# EAGLE schematic pressure_mat_try1 (EAGLE 9.3.1)

## Sheet 1 of 2
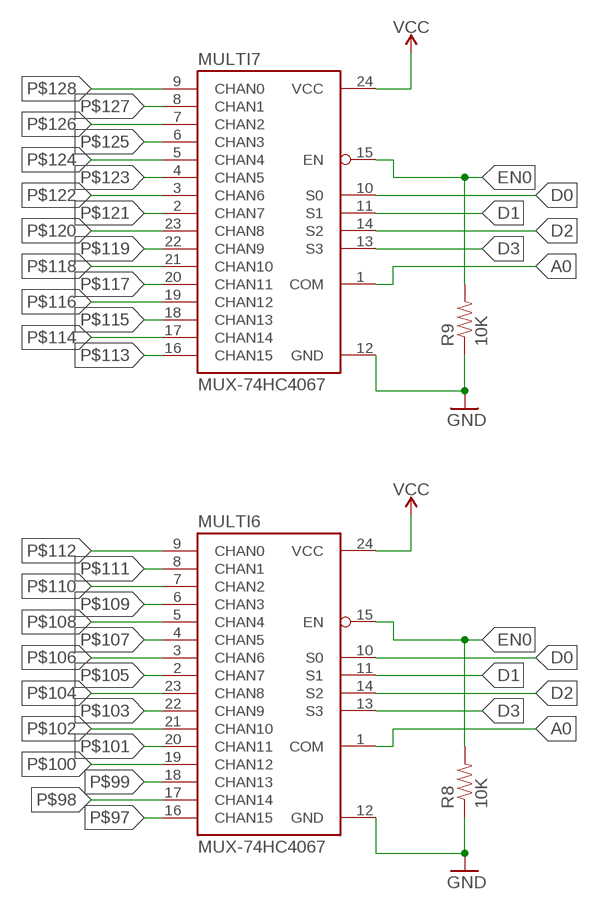
[diagram p0: schematic, sheet 1, part 1 of 3]
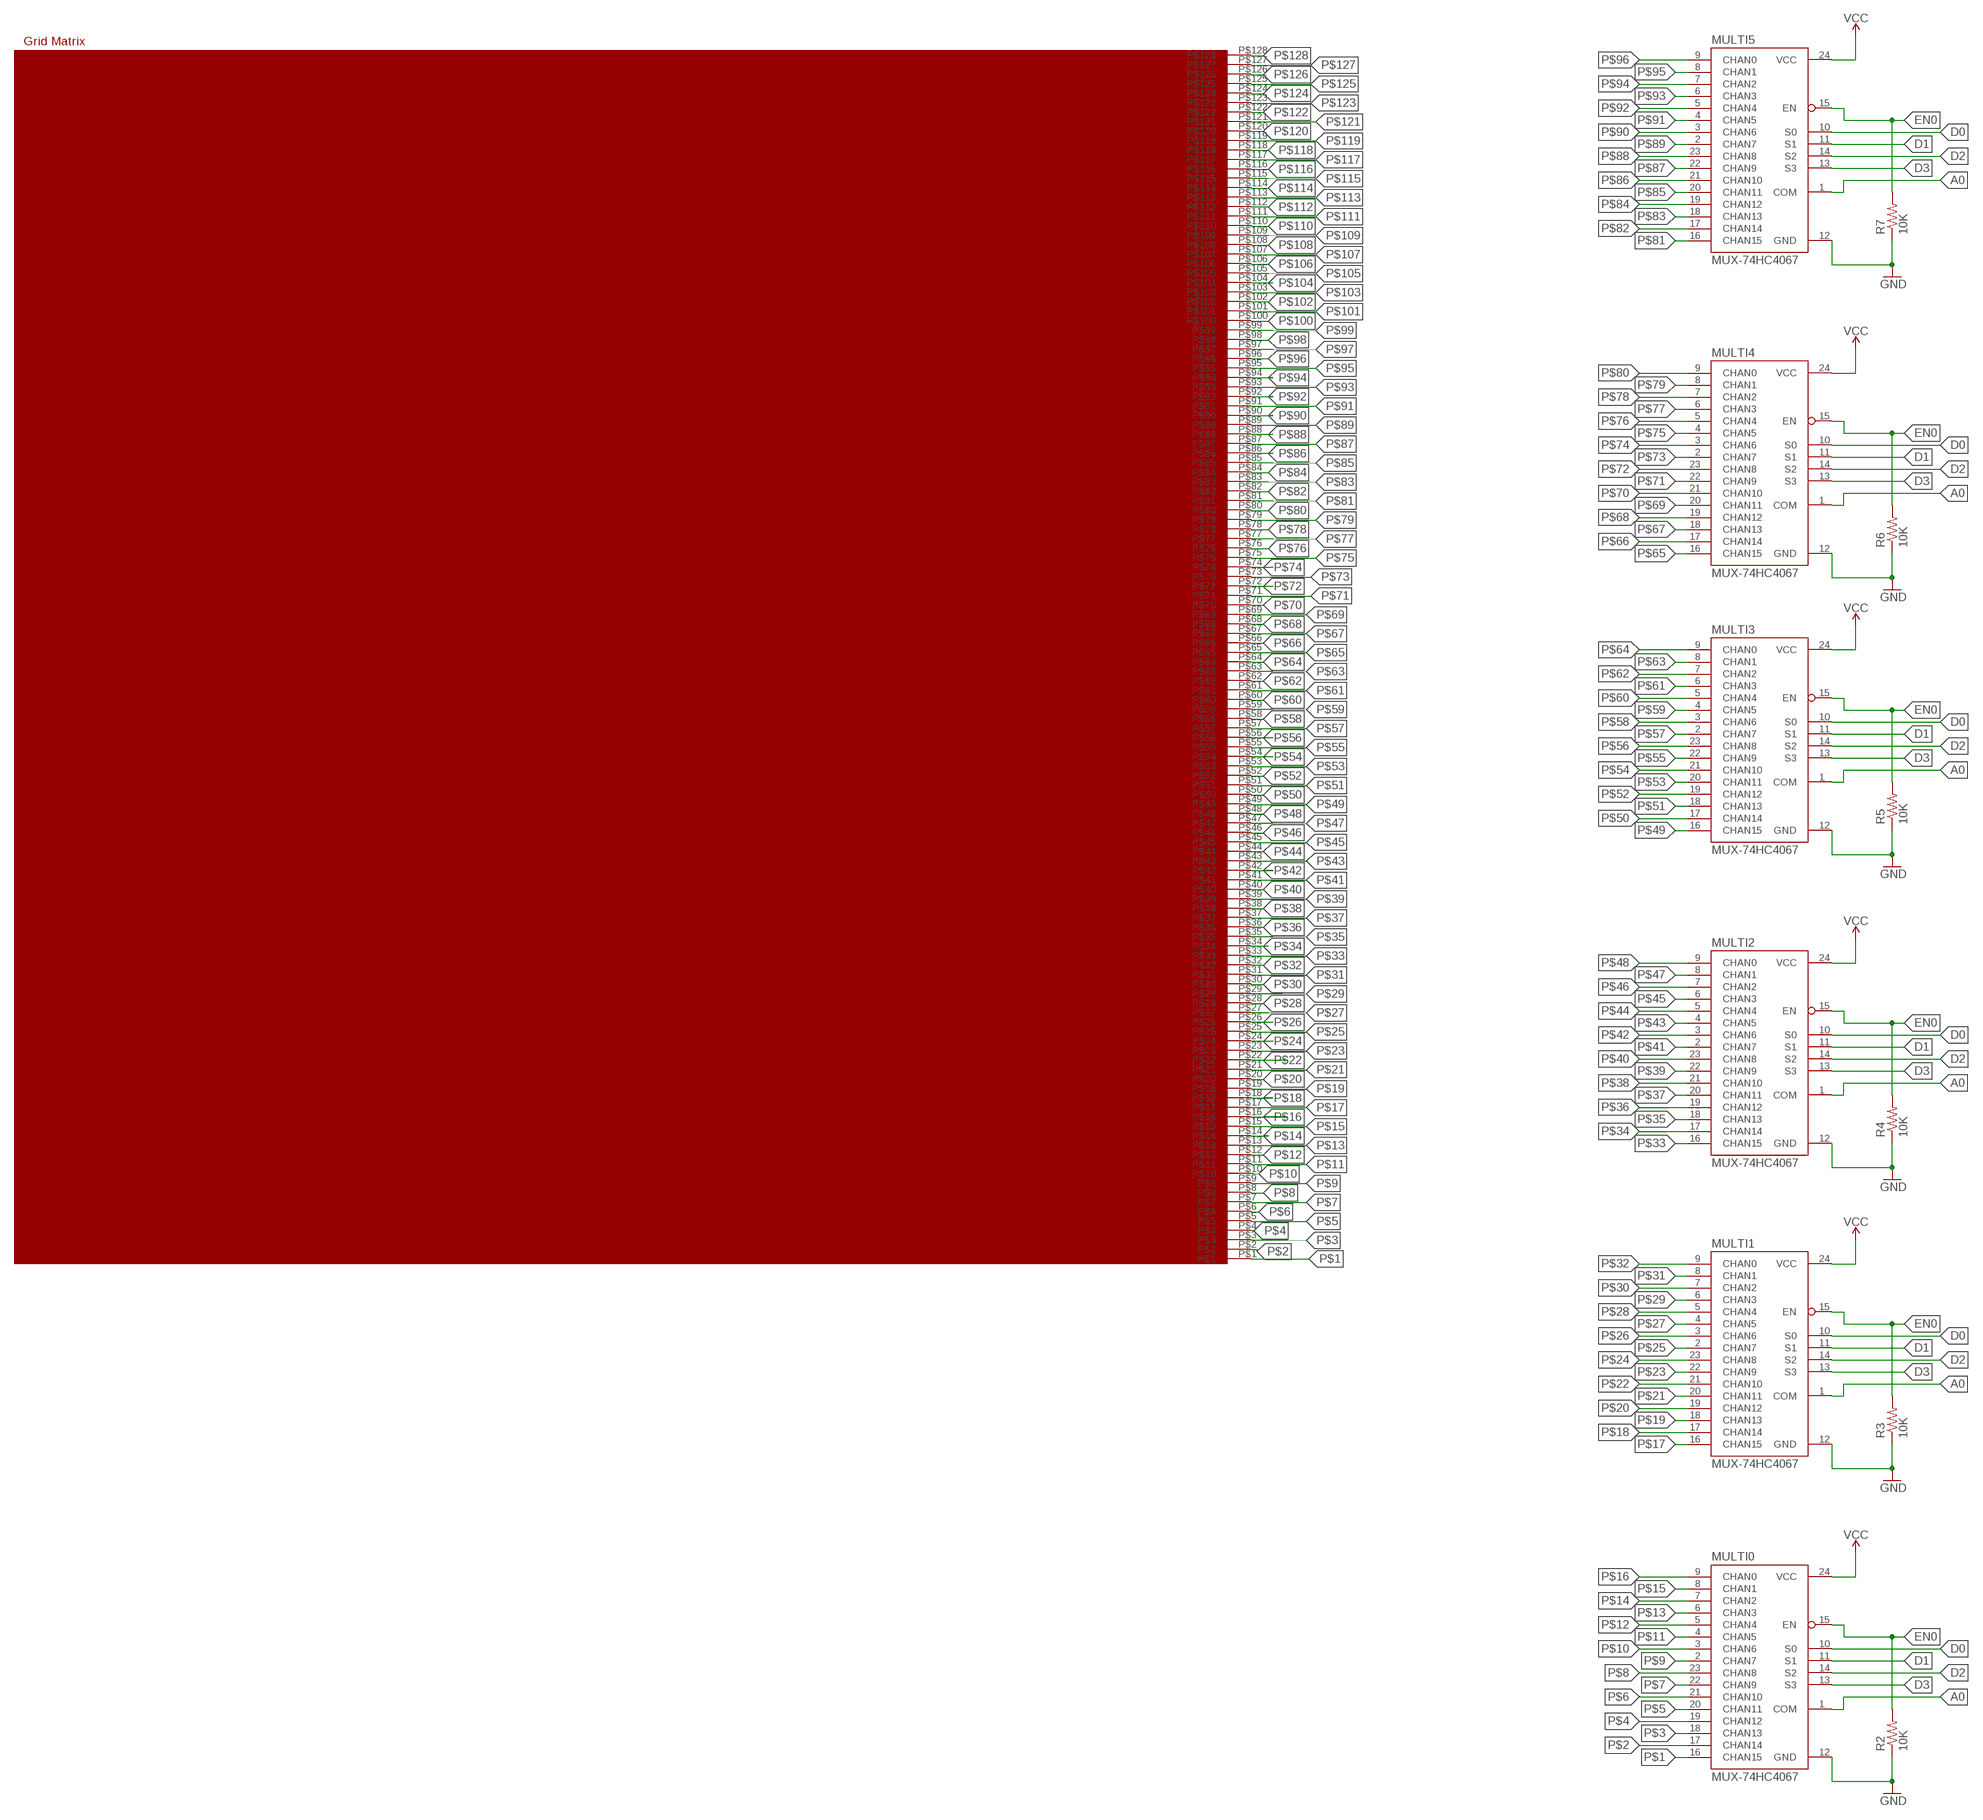
[diagram p1: schematic, sheet 1, part 2 of 3]
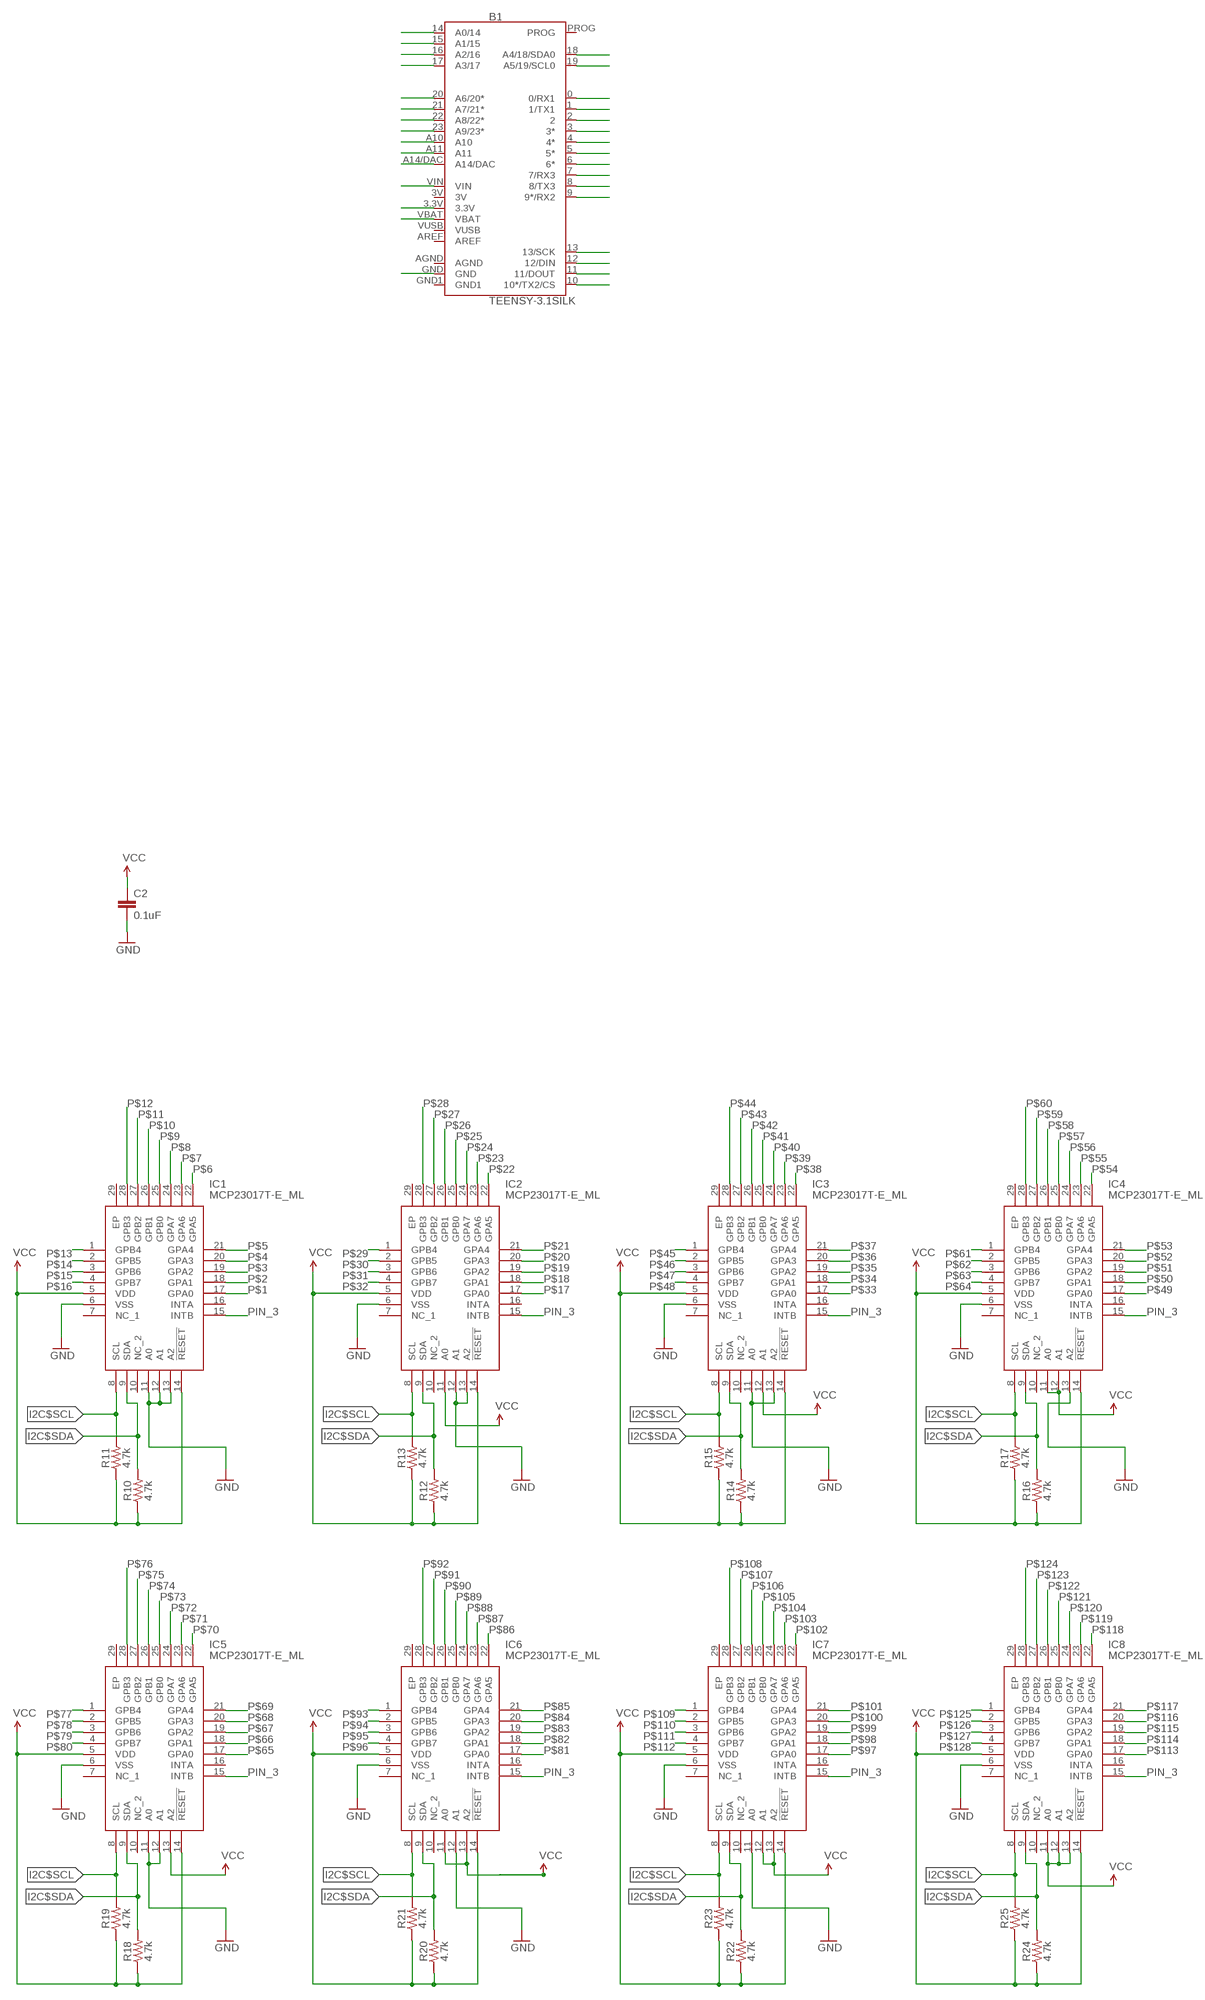
[diagram p2: schematic, sheet 1, part 3 of 3]

### Parts
B1  TEENSY-3.1SILK  [TEENSY-3.1]
C2  0.1uF  CAP0603  [0603]
IC1  MCP23017T-E_ML  [QFN65P600X600X100-29N]
IC2  MCP23017T-E_ML  [QFN65P600X600X100-29N]
IC3  MCP23017T-E_ML  [QFN65P600X600X100-29N]
IC4  MCP23017T-E_ML  [QFN65P600X600X100-29N]
IC5  MCP23017T-E_ML  [QFN65P600X600X100-29N]
IC6  MCP23017T-E_ML  [QFN65P600X600X100-29N]
IC7  MCP23017T-E_ML  [QFN65P600X600X100-29N]
IC8  MCP23017T-E_ML  [QFN65P600X600X100-29N]
MULTI0  MUX-74HC4067  MUX-74HC4067SMD  [SSOP24]
MULTI1  MUX-74HC4067  MUX-74HC4067SMD  [SSOP24]
MULTI2  MUX-74HC4067  MUX-74HC4067SMD  [SSOP24]
MULTI3  MUX-74HC4067  MUX-74HC4067SMD  [SSOP24]
MULTI4  MUX-74HC4067  MUX-74HC4067SMD  [SSOP24]
MULTI5  MUX-74HC4067  MUX-74HC4067SMD  [SSOP24]
MULTI6  MUX-74HC4067  MUX-74HC4067SMD  [SSOP24]
MULTI7  MUX-74HC4067  MUX-74HC4067SMD  [SSOP24]
R2  10K  RESISTOR0603  [0603]
R3  10K  RESISTOR0603  [0603]
R4  10K  RESISTOR0603  [0603]
R5  10K  RESISTOR0603  [0603]
R6  10K  RESISTOR0603  [0603]
R7  10K  RESISTOR0603  [0603]
R8  10K  RESISTOR0603  [0603]
R9  10K  RESISTOR0603  [0603]
R10  4.7k  4.7KOHM-0603-1/10W-1%  [0603]
R11  4.7k  4.7KOHM-0603-1/10W-1%  [0603]
R12  4.7k  4.7KOHM-0603-1/10W-1%  [0603]
R13  4.7k  4.7KOHM-0603-1/10W-1%  [0603]
R14  4.7k  4.7KOHM-0603-1/10W-1%  [0603]
R15  4.7k  4.7KOHM-0603-1/10W-1%  [0603]
R16  4.7k  4.7KOHM-0603-1/10W-1%  [0603]
R17  4.7k  4.7KOHM-0603-1/10W-1%  [0603]
R18  4.7k  4.7KOHM-0603-1/10W-1%  [0603]
R19  4.7k  4.7KOHM-0603-1/10W-1%  [0603]
R20  4.7k  4.7KOHM-0603-1/10W-1%  [0603]
R21  4.7k  4.7KOHM-0603-1/10W-1%  [0603]
R22  4.7k  4.7KOHM-0603-1/10W-1%  [0603]
R23  4.7k  4.7KOHM-0603-1/10W-1%  [0603]
R24  4.7k  4.7KOHM-0603-1/10W-1%  [0603]
R25  4.7k  4.7KOHM-0603-1/10W-1%  [0603]
U$3  SENSOR_GRID_V1.0  [SENSOR_GRID_V1.0]

### Nets
A0: MULTI0.1(COM) MULTI1.1(COM) MULTI2.1(COM) MULTI3.1(COM) MULTI4.1(COM) MULTI5.1(COM) MULTI6.1(COM) MULTI7.1(COM)
D0: MULTI0.10(S0) MULTI1.10(S0) MULTI2.10(S0) MULTI3.10(S0) MULTI4.10(S0) MULTI5.10(S0) MULTI6.10(S0) MULTI7.10(S0)
D1: MULTI0.11(S1) MULTI1.11(S1) MULTI2.11(S1) MULTI3.11(S1) MULTI4.11(S1) MULTI5.11(S1) MULTI6.11(S1) MULTI7.11(S1)
D2: MULTI0.14(S2) MULTI1.14(S2) MULTI2.14(S2) MULTI3.14(S2) MULTI4.14(S2) MULTI5.14(S2) MULTI6.14(S2) MULTI7.14(S2)
D3: MULTI0.13(S3) MULTI1.13(S3) MULTI2.13(S3) MULTI3.13(S3) MULTI4.13(S3) MULTI5.13(S3) MULTI6.13(S3) MULTI7.13(S3)
EN0: MULTI0.15(EN) MULTI1.15(EN) MULTI2.15(EN) MULTI3.15(EN) MULTI4.15(EN) MULTI5.15(EN) MULTI6.15(EN) MULTI7.15(EN) R2.2 R3.2 R4.2 R5.2 R6.2 R7.2 R8.2 R9.2
GND: C2.2 IC1.6(VSS) IC1.11(A0) IC1.12(A1) IC1.13(A2) IC2.6(VSS) IC2.12(A1) IC2.13(A2) IC3.6(VSS) IC3.11(A0) IC3.13(A2) IC4.6(VSS) IC4.13(A2) IC5.6(VSS) IC5.11(A0) IC5.12(A1) IC6.6(VSS) IC6.12(A1) IC7.6(VSS) IC7.11(A0) IC8.6(VSS) MULTI0.12(GND) MULTI1.12(GND) MULTI2.12(GND) MULTI3.12(GND) MULTI4.12(GND) MULTI5.12(GND) MULTI6.12(GND) MULTI7.12(GND) R2.1 R3.1 R4.1 R5.1 R6.1 R7.1 R8.1 R9.1 ; also sheet 2
I2C$SCL: IC1.8(SCL) IC2.8(SCL) IC3.8(SCL) IC4.8(SCL) IC5.8(SCL) IC6.8(SCL) IC7.8(SCL) IC8.8(SCL) R11.2 R13.2 R15.2 R17.2 R19.2 R21.2 R23.2 R25.2
I2C$SDA: IC1.9(SDA) IC2.9(SDA) IC3.9(SDA) IC4.9(SDA) IC5.9(SDA) IC6.9(SDA) IC7.9(SDA) IC8.9(SDA) R10.2 R12.2 R14.2 R16.2 R18.2 R20.2 R22.2 R24.2
N$1: B1.14(A0/14)
N$2: B1.15(A1/15)
N$3: B1.16(A2/16)
N$4: B1.17(A3/17)
N$5: B1.20(A6/20*)
N$6: B1.21(A7/21*)
N$7: B1.22(A8/22*)
N$8: B1.23(A9/23*)
N$9: B1.A10
N$10: B1.A11
N$11: B1.A14/DAC
N$12: B1.VIN
N$13: B1.3.3V
N$14: B1.GND
N$15: B1.18(A4/18/SDA0)
N$16: B1.VBAT
N$17: B1.19(A5/19/SCL0)
N$18: B1.0(0/RX1)
N$19: B1.1(1/TX1)
N$20: B1.2
N$21: B1.3(3*)
N$22: B1.4(4*)
N$23: B1.5(5*)
N$24: B1.6(6*)
N$25: B1.7(7/RX3)
N$26: B1.8(8/TX3)
N$27: B1.9(9*/RX2)
N$28: B1.13(13/SCK)
N$29: B1.12(12/DIN)
N$30: B1.11(11/DOUT)
N$31: B1.10(10*/TX2/CS)
P$1: IC1.17(GPA0) MULTI0.16(CHAN15) U$3.P$1
P$2: IC1.18(GPA1) MULTI0.17(CHAN14) U$3.P$2
P$3: IC1.19(GPA2) MULTI0.18(CHAN13) U$3.P$3
P$4: IC1.20(GPA3) MULTI0.19(CHAN12) U$3.P$4
P$5: IC1.21(GPA4) MULTI0.20(CHAN11) U$3.P$5
P$6: IC1.22(GPA5) MULTI0.21(CHAN10) U$3.P$6
P$7: IC1.23(GPA6) MULTI0.22(CHAN9) U$3.P$7
P$8: IC1.24(GPA7) MULTI0.23(CHAN8) U$3.P$8
P$9: IC1.25(GPB0) MULTI0.2(CHAN7) U$3.P$9
P$10: IC1.26(GPB1) MULTI0.3(CHAN6) U$3.P$10
P$11: IC1.27(GPB2) MULTI0.4(CHAN5) U$3.P$11
P$12: IC1.28(GPB3) MULTI0.5(CHAN4) U$3.P$12
P$13: IC1.1(GPB4) MULTI0.6(CHAN3) U$3.P$13
P$14: IC1.2(GPB5) MULTI0.7(CHAN2) U$3.P$14
P$15: IC1.3(GPB6) MULTI0.8(CHAN1) U$3.P$15
P$16: IC1.4(GPB7) MULTI0.9(CHAN0) U$3.P$16
P$17: IC2.17(GPA0) MULTI1.16(CHAN15) U$3.P$17
P$18: IC2.18(GPA1) MULTI1.17(CHAN14) U$3.P$18
P$19: IC2.19(GPA2) MULTI1.18(CHAN13) U$3.P$19
P$20: IC2.20(GPA3) MULTI1.19(CHAN12) U$3.P$20
P$21: IC2.21(GPA4) MULTI1.20(CHAN11) U$3.P$21
P$22: IC2.22(GPA5) MULTI1.21(CHAN10) U$3.P$22
P$23: IC2.23(GPA6) MULTI1.22(CHAN9) U$3.P$23
P$24: IC2.24(GPA7) MULTI1.23(CHAN8) U$3.P$24
P$25: IC2.25(GPB0) MULTI1.2(CHAN7) U$3.P$25
P$26: IC2.26(GPB1) MULTI1.3(CHAN6) U$3.P$26
P$27: IC2.27(GPB2) MULTI1.4(CHAN5) U$3.P$27
P$28: IC2.28(GPB3) MULTI1.5(CHAN4) U$3.P$28
P$29: IC2.1(GPB4) MULTI1.6(CHAN3) U$3.P$29
P$30: IC2.2(GPB5) MULTI1.7(CHAN2) U$3.P$30
P$31: IC2.3(GPB6) MULTI1.8(CHAN1) U$3.P$31
P$32: IC2.4(GPB7) MULTI1.9(CHAN0) U$3.P$32
P$33: IC3.17(GPA0) MULTI2.16(CHAN15) U$3.P$33
P$34: IC3.18(GPA1) MULTI2.17(CHAN14) U$3.P$34
P$35: IC3.19(GPA2) MULTI2.18(CHAN13) U$3.P$35
P$36: IC3.20(GPA3) MULTI2.19(CHAN12) U$3.P$36
P$37: IC3.21(GPA4) MULTI2.20(CHAN11) U$3.P$37
P$38: IC3.22(GPA5) MULTI2.21(CHAN10) U$3.P$38
P$39: IC3.23(GPA6) MULTI2.22(CHAN9) U$3.P$39
P$40: IC3.24(GPA7) MULTI2.23(CHAN8) U$3.P$40
P$41: IC3.25(GPB0) MULTI2.2(CHAN7) U$3.P$41
P$42: IC3.26(GPB1) MULTI2.3(CHAN6) U$3.P$42
P$43: IC3.27(GPB2) MULTI2.4(CHAN5) U$3.P$43
P$44: IC3.28(GPB3) MULTI2.5(CHAN4) U$3.P$44
P$45: IC3.1(GPB4) MULTI2.6(CHAN3) U$3.P$45
P$46: IC3.2(GPB5) MULTI2.7(CHAN2) U$3.P$46
P$47: IC3.3(GPB6) MULTI2.8(CHAN1) U$3.P$47
P$48: IC3.4(GPB7) MULTI2.9(CHAN0) U$3.P$48
P$49: IC4.17(GPA0) MULTI3.16(CHAN15) U$3.P$49
P$50: IC4.18(GPA1) MULTI3.17(CHAN14) U$3.P$50
P$51: IC4.19(GPA2) MULTI3.18(CHAN13) U$3.P$51
P$52: IC4.20(GPA3) MULTI3.19(CHAN12) U$3.P$52
P$53: IC4.21(GPA4) MULTI3.20(CHAN11) U$3.P$53
P$54: IC4.22(GPA5) MULTI3.21(CHAN10) U$3.P$54
P$55: IC4.23(GPA6) MULTI3.22(CHAN9) U$3.P$55
P$56: IC4.24(GPA7) MULTI3.23(CHAN8) U$3.P$56
P$57: IC4.25(GPB0) MULTI3.2(CHAN7) U$3.P$57
P$58: IC4.26(GPB1) MULTI3.3(CHAN6) U$3.P$58
P$59: IC4.27(GPB2) MULTI3.4(CHAN5) U$3.P$59
P$60: IC4.28(GPB3) MULTI3.5(CHAN4) U$3.P$60
P$61: IC4.1(GPB4) MULTI3.6(CHAN3) U$3.P$61
P$62: IC4.2(GPB5) MULTI3.7(CHAN2) U$3.P$62
P$63: IC4.3(GPB6) MULTI3.8(CHAN1) U$3.P$63
P$64: IC4.4(GPB7) MULTI3.9(CHAN0) U$3.P$64
P$65: IC5.17(GPA0) MULTI4.16(CHAN15) U$3.P$65
P$66: IC5.18(GPA1) MULTI4.17(CHAN14) U$3.P$66
P$67: IC5.19(GPA2) MULTI4.18(CHAN13) U$3.P$67
P$68: IC5.20(GPA3) MULTI4.19(CHAN12) U$3.P$68
P$69: IC5.21(GPA4) MULTI4.20(CHAN11) U$3.P$69
P$70: IC5.22(GPA5) MULTI4.21(CHAN10) U$3.P$70
P$71: IC5.23(GPA6) MULTI4.22(CHAN9) U$3.P$71
P$72: IC5.24(GPA7) MULTI4.23(CHAN8) U$3.P$72
P$73: IC5.25(GPB0) MULTI4.2(CHAN7) U$3.P$73
P$74: IC5.26(GPB1) MULTI4.3(CHAN6) U$3.P$74
P$75: IC5.27(GPB2) MULTI4.4(CHAN5) U$3.P$75
P$76: IC5.28(GPB3) MULTI4.5(CHAN4) U$3.P$76
P$77: IC5.1(GPB4) MULTI4.6(CHAN3) U$3.P$77
P$78: IC5.2(GPB5) MULTI4.7(CHAN2) U$3.P$78
P$79: IC5.3(GPB6) MULTI4.8(CHAN1) U$3.P$79
P$80: IC5.4(GPB7) MULTI4.9(CHAN0) U$3.P$80
P$81: IC6.17(GPA0) MULTI5.16(CHAN15) U$3.P$81
P$82: IC6.18(GPA1) MULTI5.17(CHAN14) U$3.P$82
P$83: IC6.19(GPA2) MULTI5.18(CHAN13) U$3.P$83
P$84: IC6.20(GPA3) MULTI5.19(CHAN12) U$3.P$84
P$85: IC6.21(GPA4) MULTI5.20(CHAN11) U$3.P$85
P$86: IC6.22(GPA5) MULTI5.21(CHAN10) U$3.P$86
P$87: IC6.23(GPA6) MULTI5.22(CHAN9) U$3.P$87
P$88: IC6.24(GPA7) MULTI5.23(CHAN8) U$3.P$88
P$89: IC6.25(GPB0) MULTI5.2(CHAN7) U$3.P$89
P$90: IC6.26(GPB1) MULTI5.3(CHAN6) U$3.P$90
P$91: IC6.27(GPB2) MULTI5.4(CHAN5) U$3.P$91
P$92: IC6.28(GPB3) MULTI5.5(CHAN4) U$3.P$92
P$93: IC6.1(GPB4) MULTI5.6(CHAN3) U$3.P$93
P$94: IC6.2(GPB5) MULTI5.7(CHAN2) U$3.P$94
P$95: IC6.3(GPB6) MULTI5.8(CHAN1) U$3.P$95
P$96: IC6.4(GPB7) MULTI5.9(CHAN0) U$3.P$96
P$97: IC7.17(GPA0) MULTI6.16(CHAN15) U$3.P$97
P$98: IC7.18(GPA1) MULTI6.17(CHAN14) U$3.P$98
P$99: IC7.19(GPA2) MULTI6.18(CHAN13) U$3.P$99
P$100: IC7.20(GPA3) MULTI6.19(CHAN12) U$3.P$100
P$101: IC7.21(GPA4) MULTI6.20(CHAN11) U$3.P$101
P$102: IC7.22(GPA5) MULTI6.21(CHAN10) U$3.P$102
P$103: IC7.23(GPA6) MULTI6.22(CHAN9) U$3.P$103
P$104: IC7.24(GPA7) MULTI6.23(CHAN8) U$3.P$104
P$105: IC7.25(GPB0) MULTI6.2(CHAN7) U$3.P$105
P$106: IC7.26(GPB1) MULTI6.3(CHAN6) U$3.P$106
P$107: IC7.27(GPB2) MULTI6.4(CHAN5) U$3.P$107
P$108: IC7.28(GPB3) MULTI6.5(CHAN4) U$3.P$108
P$109: IC7.1(GPB4) MULTI6.6(CHAN3) U$3.P$109
P$110: IC7.2(GPB5) MULTI6.7(CHAN2) U$3.P$110
P$111: IC7.3(GPB6) MULTI6.8(CHAN1) U$3.P$111
P$112: IC7.4(GPB7) MULTI6.9(CHAN0) U$3.P$112
P$113: IC8.17(GPA0) MULTI7.16(CHAN15) U$3.P$113
P$114: IC8.18(GPA1) MULTI7.17(CHAN14) U$3.P$114
P$115: IC8.19(GPA2) MULTI7.18(CHAN13) U$3.P$115
P$116: IC8.20(GPA3) MULTI7.19(CHAN12) U$3.P$116
P$117: IC8.21(GPA4) MULTI7.20(CHAN11) U$3.P$117
P$118: IC8.22(GPA5) MULTI7.21(CHAN10) U$3.P$118
P$119: IC8.23(GPA6) MULTI7.22(CHAN9) U$3.P$119
P$120: IC8.24(GPA7) MULTI7.23(CHAN8) U$3.P$120
P$121: IC8.25(GPB0) MULTI7.2(CHAN7) U$3.P$121
P$122: IC8.26(GPB1) MULTI7.3(CHAN6) U$3.P$122
P$123: IC8.27(GPB2) MULTI7.4(CHAN5) U$3.P$123
P$124: IC8.28(GPB3) MULTI7.5(CHAN4) U$3.P$124
P$125: IC8.1(GPB4) MULTI7.6(CHAN3) U$3.P$125
P$126: IC8.2(GPB5) MULTI7.7(CHAN2) U$3.P$126
P$127: IC8.3(GPB6) MULTI7.8(CHAN1) U$3.P$127
P$128: IC8.4(GPB7) MULTI7.9(CHAN0) U$3.P$128
PIN_3: IC1.15(INTB) IC2.15(INTB) IC3.15(INTB) IC4.15(INTB) IC5.15(INTB) IC6.15(INTB) IC7.15(INTB) IC8.15(INTB)
VCC: C2.1 IC1.5(VDD) IC1.14(!RESET) IC2.5(VDD) IC2.11(A0) IC2.14(!RESET) IC3.5(VDD) IC3.12(A1) IC3.14(!RESET) IC4.5(VDD) IC4.11(A0) IC4.12(A1) IC4.14(!RESET) IC5.5(VDD) IC5.13(A2) IC5.14(!RESET) IC6.5(VDD) IC6.11(A0) IC6.13(A2) IC6.14(!RESET) IC7.5(VDD) IC7.12(A1) IC7.13(A2) IC7.14(!RESET) IC8.5(VDD) IC8.11(A0) IC8.12(A1) IC8.13(A2) IC8.14(!RESET) MULTI0.24(VCC) MULTI1.24(VCC) MULTI2.24(VCC) MULTI3.24(VCC) MULTI4.24(VCC) MULTI5.24(VCC) MULTI6.24(VCC) MULTI7.24(VCC) R10.1 R11.1 R12.1 R13.1 R14.1 R15.1 R16.1 R17.1 R18.1 R19.1 R20.1 R21.1 R22.1 R23.1 R24.1 R25.1 ; also sheet 2
Unconnected: B1.AREF B1.PROG IC1.7(NC_1) IC1.10(NC_2) IC1.16(INTA) IC1.29(EP) IC2.7(NC_1) IC2.10(NC_2) IC2.16(INTA) IC2.29(EP) IC3.7(NC_1) IC3.10(NC_2) IC3.16(INTA) IC3.29(EP) IC4.7(NC_1) IC4.10(NC_2) IC4.16(INTA) IC4.29(EP) IC5.7(NC_1) IC5.10(NC_2) IC5.16(INTA) IC5.29(EP) IC6.7(NC_1) IC6.10(NC_2) IC6.16(INTA) IC6.29(EP) IC7.7(NC_1) IC7.10(NC_2) IC7.16(INTA) IC7.29(EP) IC8.7(NC_1) IC8.10(NC_2) IC8.16(INTA) IC8.29(EP)

## Sheet 2 of 2
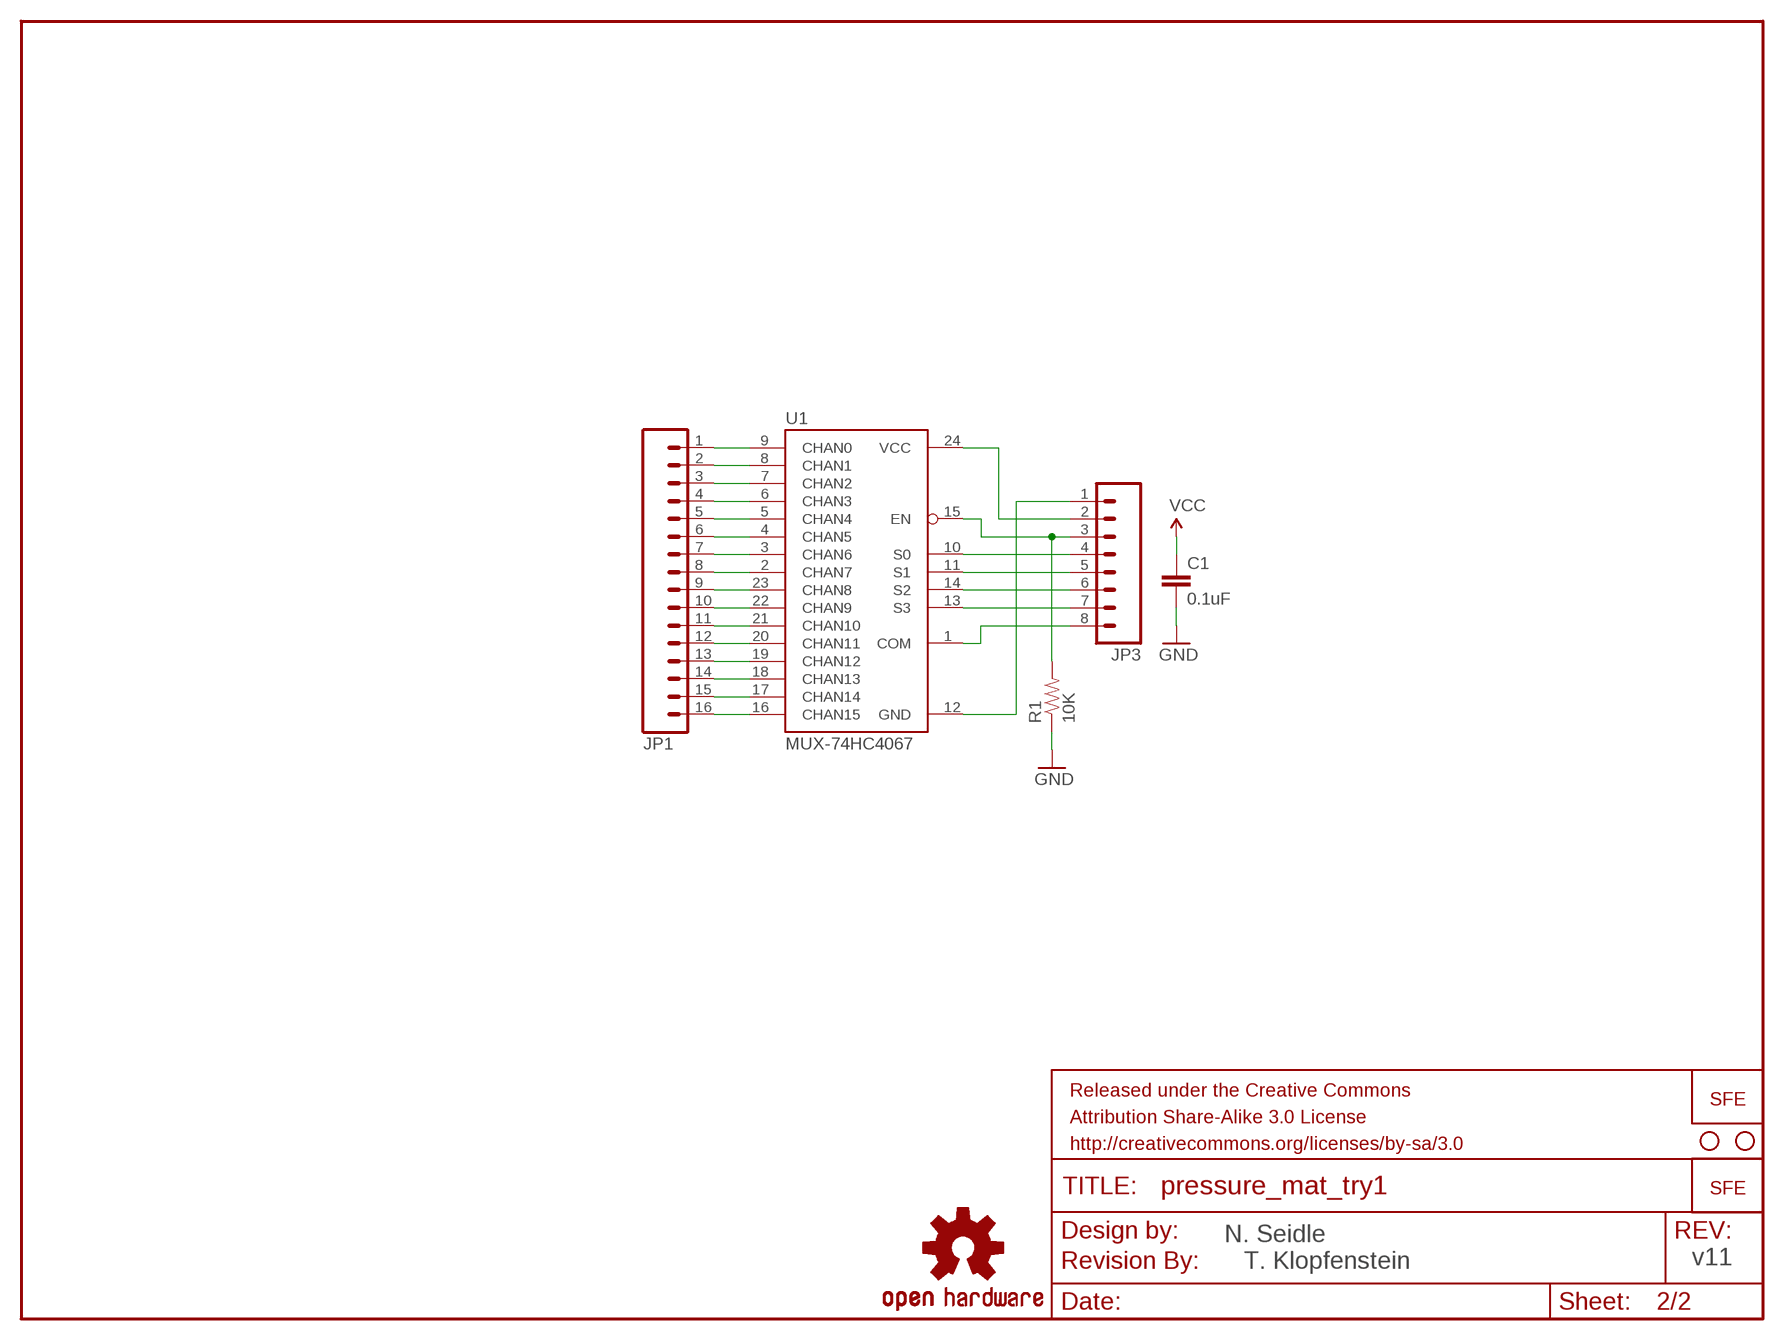
[diagram p3: schematic, sheet 2]

### Parts
C1  0.1uF  CAP0603  [0603]
FRAME1  FRAME-LETTER  [CREATIVE_COMMONS]
JP1  M16PTH  [1X16]
JP3  M081X08  [1X08]
LOGO1  OSHW-LOGOL  [OSHW-LOGO-L]
LOGO2  LOGO-SFESK  [SFE-LOGO-FLAME]
R1  10K  RESISTOR0603  [0603]
STANDOFF1  STAND-OFF  [STAND-OFF]
STANDOFF2  STAND-OFF  [STAND-OFF]
U1  MUX-74HC4067  MUX-74HC4067SMD  [SSOP24]
U$1  LOGO-SFENEW  [SFE-NEW-WEBLOGO]
U$2  REVISION  [REVISION]

### Nets
C0: JP1.1 U1.9(CHAN0)
C1: JP1.2 U1.8(CHAN1)
C2: JP1.3 U1.7(CHAN2)
C3: JP1.4 U1.6(CHAN3)
C4: JP1.5 U1.5(CHAN4)
C5: JP1.6 U1.4(CHAN5)
C6: JP1.7 U1.3(CHAN6)
C7: JP1.8 U1.2(CHAN7)
C8: JP1.9 U1.23(CHAN8)
C9: JP1.10 U1.22(CHAN9)
C10: JP1.11 U1.21(CHAN10)
C11: JP1.12 U1.20(CHAN11)
C12: JP1.13 U1.19(CHAN12)
C13: JP1.14 U1.18(CHAN13)
C14: JP1.15 U1.17(CHAN14)
C15: JP1.16 U1.16(CHAN15)
EN: JP3.3 R1.2 U1.15(EN)
GND: C1.2 JP3.1 R1.1 U1.12(GND) ; also sheet 1
S0: JP3.4 U1.10(S0)
S1: JP3.5 U1.11(S1)
S2: JP3.6 U1.14(S2)
S3: JP3.7 U1.13(S3)
SIG: JP3.8 U1.1(COM)
VCC: C1.1 JP3.2 U1.24(VCC) ; also sheet 1

### Notes on the sheet
- N. Seidle
- T. Klopfenstein | v11

## Power pins joined to a net without a drawn wire
3V: B1.3V
AGND: B1.AGND
GND1: B1.GND1
VUSB: B1.VUSB

## Library data of the parts
B1 = SparkFun-Boards:TEENSY-3.1: Teensy 3+ Footprint Mechanical footprint with connectors for Teensy Development Board with ARM Cortex. SparkFun Products: Teensy 3.2 <https://www.sparkfun.com/products/13736> Teensy LC <https://www.sparkfun.com/products/13305>; SF_ID: DEV-12646
C1 C2 = SparkFun:CAP: Capacitor Standard 0603 ceramic capacitor, and 0.1" leaded capacitor.
FRAME1 = SparkFun-Aesthetics:FRAME-LETTER: Schematic Frame Standard 8.5x11 US Letter frame
IC1-IC8 = SamacSys_Parts:MCP23017T-E_ML: Interface - I/O Expanders 16bit Input/Output Exp I2C interface Source: Datasheet <http://www.mouser.com/datasheet/2/268/20001952C-1129816.pdf>; DESCRIPTION: Interface - I/O Expanders 16bit Input/Output Exp I2C interface; HEIGHT: 1mm; MANUFACTURER_NAME: Microchip; MANUFACTURER_PART_NUMBER: MCP23017T-E/ML; MOUSER_PART_NUMBER: 579-MCP23017T-E/ML
JP1 = SparkFun-Connectors:M16: 1x16 .1" header
JP3 = SparkFun-Connectors:M08: Header 8 Standard 8-pin 0.1" header. Use with straight break away headers (SKU : PRT-00116), right angle break away headers (PRT-00553), swiss pins (PRT-00743), machine pins (PRT-00117), and female headers (PRT-00115).
LOGO1 = SparkFun-Aesthetics:OSHW-LOGO: Open Source Hardware Logo This logo indicates the piece of hardware it is found on incorporates a OSHW license and/or adheres to the definition of open source hardware found here: http://freedomdefined.org/OSHW
LOGO2 = SparkFun-Aesthetics:LOGO-SFE: Spark Fun Electronics PCB Logo This is the standard Spark Fun Electronics PCB logo.
MULTI0 MULTI1-MULTI7 U1 = SparkFun:MUX-74HC4067
R1-R9 = SparkFun:RESISTOR: Resistor Basic schematic elements and footprints for 0603, 1206, and PTH 1/10th watt (small) resistors.
R10-R25 = SparkFun-Resistors:4.7KOHM: 4.7kΩ resistor A resistor is a passive two-terminal electrical component that implements electrical resistance as a circuit element. Resistors act to reduce current flow, and, at the same time, act to lower voltage levels within circuits. - Wikipedia; PROD_ID: RES-07857
STANDOFF1 STANDOFF2 = SparkFun-Electromechanical:STAND-OFF: #4 Stand Off This is the mechanical footprint for a #4 phillips button head screw. Use the keepout ring to avoid running the screw head into surrounding components. SKU : PRT-00447
U$1 = SparkFun:LOGO-SFE: Spark Fun Electronics PCB Logo This is the standard Spark Fun Electronics PCB logo.
U$2 = SparkFun-Aesthetics:REVISION
U$3 = Pressure_Pad:SENSOR_GRID_V1.0